# EAGLE design quasi_bb_shield_midi (EAGLE 9.4.2)
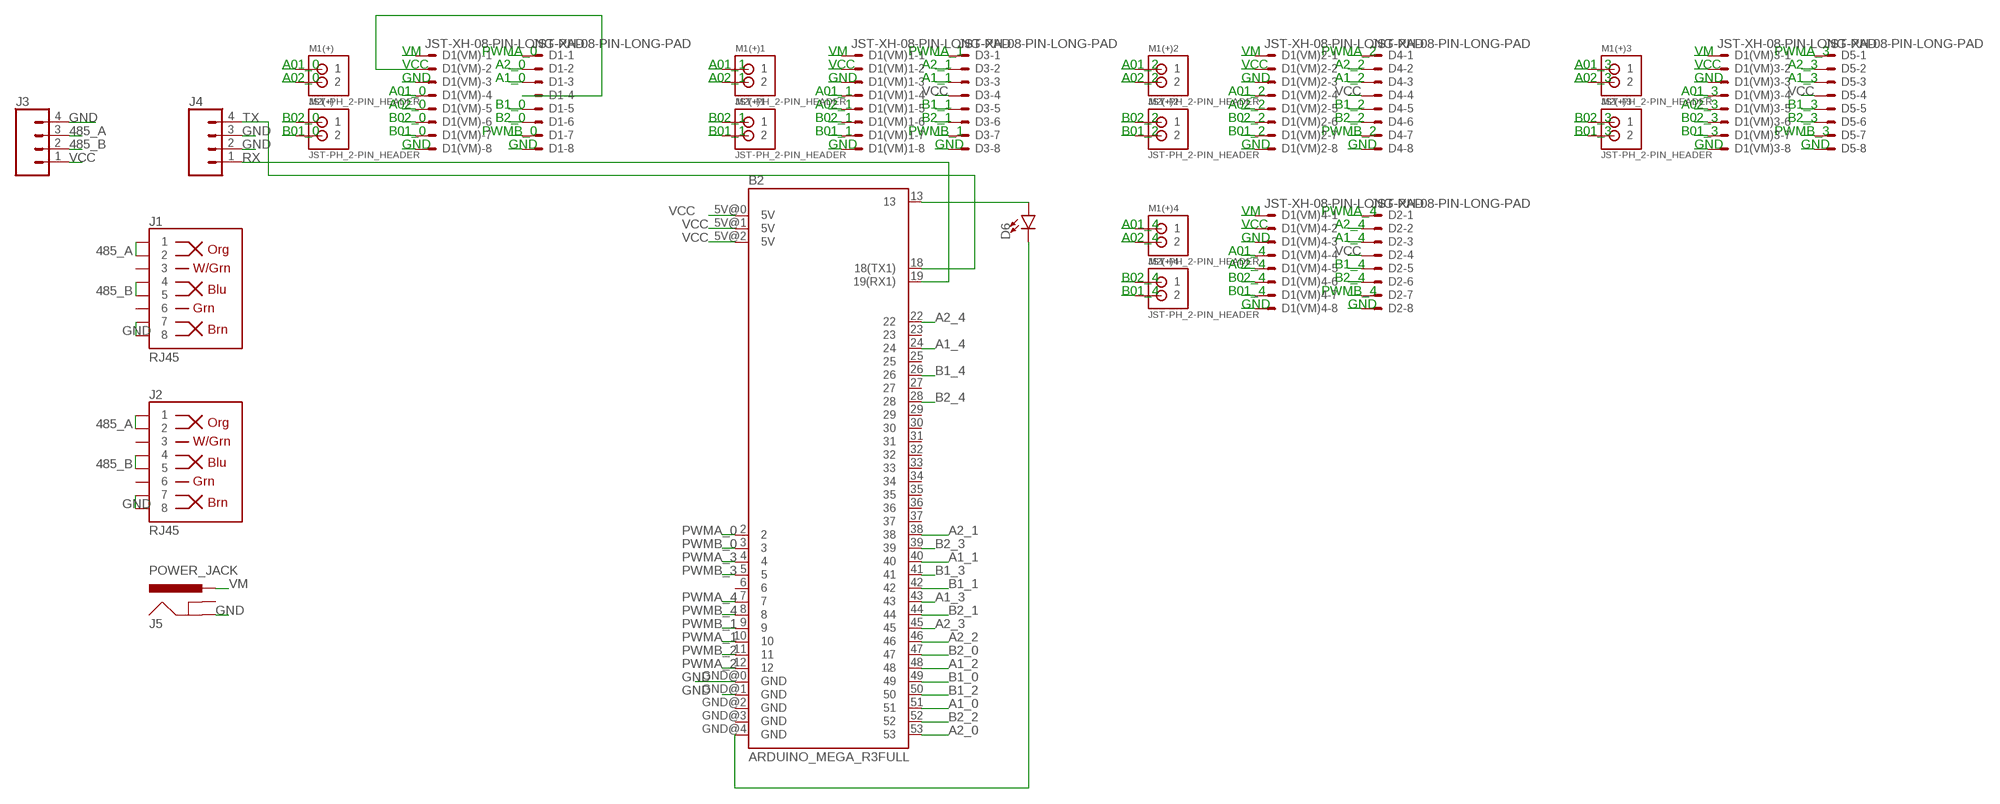
[diagram p0: schematic, sheet 1]

## Parts
B2  ARDUINO_MEGA_R3FULL  [ARDUINO_MEGA]
D1  JST-XH-08-PIN-LONG-PAD  [JST-XH-08-PACKAGE-LONG-PAD]
D1(VM)  JST-XH-08-PIN-LONG-PAD  [JST-XH-08-PACKAGE-LONG-PAD]
D1(VM)1  JST-XH-08-PIN-LONG-PAD  [JST-XH-08-PACKAGE-LONG-PAD]
D1(VM)2  JST-XH-08-PIN-LONG-PAD  [JST-XH-08-PACKAGE-LONG-PAD]
D1(VM)3  JST-XH-08-PIN-LONG-PAD  [JST-XH-08-PACKAGE-LONG-PAD]
D1(VM)4  JST-XH-08-PIN-LONG-PAD  [JST-XH-08-PACKAGE-LONG-PAD]
D2  JST-XH-08-PIN-LONG-PAD  [JST-XH-08-PACKAGE-LONG-PAD]
D3  JST-XH-08-PIN-LONG-PAD  [JST-XH-08-PACKAGE-LONG-PAD]
D4  JST-XH-08-PIN-LONG-PAD  [JST-XH-08-PACKAGE-LONG-PAD]
D5  JST-XH-08-PIN-LONG-PAD  [JST-XH-08-PACKAGE-LONG-PAD]
D6  LED-3MM-NO_SILK  [LED_3MM-NS]
J1  RJ45  RJ45-8  [RJ45-8]
J2  RJ45  RJ45-8  [RJ45-8]
J3  CONN_04  [1X04]
J4  CONN_04  [1X04]
J5  POWER_JACK  [POWER_JACK_PTH]
M1(+)  JST-PH_2-PIN_HEADER  [JST_B2B-PH_HEADER]
M1(+)1  JST-PH_2-PIN_HEADER  [JST_B2B-PH_HEADER]
M1(+)2  JST-PH_2-PIN_HEADER  [JST_B2B-PH_HEADER]
M1(+)3  JST-PH_2-PIN_HEADER  [JST_B2B-PH_HEADER]
M1(+)4  JST-PH_2-PIN_HEADER  [JST_B2B-PH_HEADER]
M2(+)  JST-PH_2-PIN_HEADER  [JST_B2B-PH_HEADER]
M2(+)1  JST-PH_2-PIN_HEADER  [JST_B2B-PH_HEADER]
M2(+)2  JST-PH_2-PIN_HEADER  [JST_B2B-PH_HEADER]
M2(+)3  JST-PH_2-PIN_HEADER  [JST_B2B-PH_HEADER]
M2(+)4  JST-PH_2-PIN_HEADER  [JST_B2B-PH_HEADER]

## Nets
485_A: J1.1 J1.2 J2.1 J2.2 J3.3
485_B: J1.4 J1.5 J2.4 J2.5 J3.2
A01_0: D1(VM).4 M1(+).P1
A1_0: B2.51 D1.3
A01_1: D1(VM)1.4 M1(+)1.P1
A1_1: B2.40 D3.3
A01_2: D1(VM)2.4 M1(+)2.P1
A1_2: B2.48 D4.3
A01_3: D1(VM)3.4 M1(+)3.P1
A1_3: B2.43 D5.3
A01_4: D1(VM)4.4 M1(+)4.P1
A1_4: B2.24 D2.3
A02_0: D1(VM).5 M1(+).P2
A2_0: B2.53 D1.2
A02_1: D1(VM)1.5 M1(+)1.P2
A2_1: B2.38 D3.2
A02_2: D1(VM)2.5 M1(+)2.P2
A2_2: B2.46 D4.2
A02_3: D1(VM)3.5 M1(+)3.P2
A2_3: B2.45 D5.2
A02_4: D1(VM)4.5 M1(+)4.P2
A2_4: B2.22 D2.2
B01_0: D1(VM).7 M2(+).P2
B1_0: B2.49 D1.5
B01_1: D1(VM)1.7 M2(+)1.P2
B1_1: B2.42 D3.5
B01_2: D1(VM)2.7 M2(+)2.P2
B1_2: B2.50 D4.5
B01_3: D1(VM)3.7 M2(+)3.P2
B1_3: B2.41 D5.5
B01_4: D1(VM)4.7 M2(+)4.P2
B1_4: B2.26 D2.5
B02_0: D1(VM).6 M2(+).P1
B2_0: B2.47 D1.6
B02_1: D1(VM)1.6 M2(+)1.P1
B2_1: B2.44 D3.6
B02_2: D1(VM)2.6 M2(+)2.P1
B2_2: B2.52 D4.6
B02_3: D1(VM)3.6 M2(+)3.P1
B2_3: B2.39 D5.6
B02_4: D1(VM)4.6 M2(+)4.P1
B2_4: B2.28 D2.6
GND: B2.GND@0(GND) B2.GND@1(GND) D1(VM)1.3 D1(VM)1.8 D1(VM)2.3 D1(VM)2.8 D1(VM)3.3 D1(VM)3.8 D1(VM)4.3 D1(VM)4.8 D1(VM).3 D1(VM).8 D1.8 D2.8 D3.8 D4.8 D5.8 J1.7 J1.8 J2.7 J2.8 J3.4 J4.2 J4.3 J5.GND
N$1: B2.13 D6.A
N$2: B2.GND@4(GND) D6.K(C)
PWMA_0: B2.2 D1.1
PWMA_1: B2.10 D3.1
PWMA_2: B2.12 D4.1
PWMA_3: B2.4 D5.1
PWMA_4: B2.7 D2.1
PWMB_0: B2.3 D1.7
PWMB_1: B2.9 D3.7
PWMB_2: B2.11 D4.7
PWMB_3: B2.5 D5.7
PWMB_4: B2.8 D2.7
RX: B2.19(19(RX1)) J4.1
TX: B2.18(18(TX1)) J4.4
VCC: B2.5V@0(5V) B2.5V@1(5V) B2.5V@2(5V) D1(VM)1.2 D1(VM)2.2 D1(VM)3.2 D1(VM)4.2 D1(VM).2 D1.4 D2.4 D3.4 D4.4 D5.4 J3.1
VM: D1(VM)1.1 D1(VM)2.1 D1(VM)3.1 D1(VM)4.1 D1(VM).1 J5.PWR
Unconnected: B2.6 B2.23 B2.25 B2.27 B2.29 B2.30 B2.31 B2.32 B2.33 B2.34 B2.35 B2.36 B2.37 B2.GND@2(GND) B2.GND@3(GND) J1.3 J1.6 J2.3 J2.6 J5.GNDBREAK

## Library data of the parts
B2 = mega-simple:ARDUINO_MEGA_R3: Arduino Mega R3 ATmega2560 R3 compatible footprint. SparkFun Products: Arduino Mega 2560 R3 <https://www.sparkfun.com/products/11061>
D1 D1(VM) D1(VM)1-D1(VM)4 D2-D5 = Rembrandt Electronics - JST XH Connectors v1-0:JST-XH-08-PIN: JST XH Connector 2 Pin Wire to board connector. Pitch: 2,54 mm, (0.100") Number of pins: 8 Created by Rembrandt Electronics www.rembrandtelectronics.com
D6 = SparkFun-LED:LED: LED (Generic) Standard schematic elements and footprints for 5mm, 3mm, 1206, and 0603 sized LEDs. Generic LEDs with no color specified.
J1 J2 = SparkFun-Connectors:RJ45-8: RJ45 Jack - 8 pin Simple RJ45, 8-pin connection. Commonly used for Cat5, Cat5e, and Cat6 Ethernet cables. Here is the connector we sell at SparkFun: RJ45 8-Pin Connector <https://www.sparkfun.com/products/643> (PRT-00643) Datasheet <https://cdn.sparkfun.com/datasheets/Prototyping/04908.pdf> It is used on this SparkFun product: SparkFun RJ45 Breakout <https://www.sparkfun.com/products/716> (BOB-00716) Note, you may also be interested in the "MAGJACK" version of this. It is basically a RJ45 connector, but also has some status LEDs built into the connector housing. You can check that out in this library at the device named "MAGJACK.dev" and see these products online: RJ45 Ethernet MagJack-Compatible <https://www.sparkfun.com/products/8534> (PRT-08534) SparkFun RJ45 MagJack Breakout <https://www.sparkfun.com/products/13021> (BOB-13021); PROD_ID: CONN-08506; SF_ID: PRT-00643
J3 J4 = SparkFun-Connectors:CONN_04: Multi connection point. Often used as Generic Header-pin footprint for 0.1 inch spaced/style header connections On any of the 0.1 inch spaced packages, you can populate with these: Break Away Headers - Straight <https://www.sparkfun.com/products/116> (PRT-00116) Break Away Male Headers - Right Angle <https://www.sparkfun.com/products/553> (PRT-00553) Female Headers <https://www.sparkfun.com/products/115> (PRT-00115) Break Away Headers - Machine Pin <https://www.sparkfun.com/products/117> (PRT-00117) Break Away Female Headers - Swiss Machine Pin <https://www.sparkfun.com/products/743> (PRT-00743) For SCREWTERMINALS and SPRING TERMINALS visit here: Screw Terimnals on SparkFun.com <https://www.sparkfun.com/search/results?term=Screw+Terminals> (5mm/3.5mm/2.54mm spacing) This device is also useful as a general connection point to wire up your design to another part of your project. Our various solder wires solder well into these plated through hole pads. Hook-Up Wire - Assortment (Stranded, 22 AWG) <https://www.sparkfun.com/products/11375> (PRT-11375) Hook-Up Wire - Assortment (Solid Core, 22 AWG) <https://www.sparkfun.com/products/11367> (PRT-11367) View the entire wire category on our website here <https://www.sparkfun.com/categories/141> Special notes: Molex polarized connector foot print use with SKU : PRT-08231 with associated crimp pins and housings. 1MM SMD Version SKU: PRT-10208; PROD_ID: CONN-09696
J5 = SparkFun-Connectors:POWER_JACK: Power Jack Connector This is the standard 5.5mm barrel jack for power. The PTH is the most common, proven, reliable, footprint. The Slot footprint only works if the mill layer is transmitted to the PCB fab house so be warned. Here are the connectors we sell at SparkFun: DC Barrel Power Jack/Connector <https://www.sparkfun.com/products/119> (PRT-00119) DC Barrel Power Jack/Connector (SMD) <https://www.sparkfun.com/products/12748> (PRT-12748) DC Barrel Jack Adapter - Breadboard Compatible <https://www.sparkfun.com/products/10811> (PRT-10811) It is used on this SparkFun product (and many, many others): SparkFun RedBoard - Programmed with Arduino <https://www.sparkfun.com/products/12757> (DEV-12757) Also, if you need a mating power supply or connector, please check these out: Wall Adapter Power Supply - 9VDC 650mA <https://www.sparkfun.com/products/298> (TOL-00298) DC Barrel Jack Adapter - Male <https://www.sparkfun.com/products/10287> (PRT-10287); PROD_ID: CONN-08197
M1(+) M1(+)1-M1(+)4 M2(+) M2(+)1-M2(+)4 = con-jst-ph:JST-PH_2-PIN_HEADER: 2-pin JST PH Shrouded Header, top entry P/N B2B-PH-K-S Mating connector PHR-2 Mating cable assembly: Sparkfun PRT-09914 <http://www.sparkfun.com/products/9914>

## Board
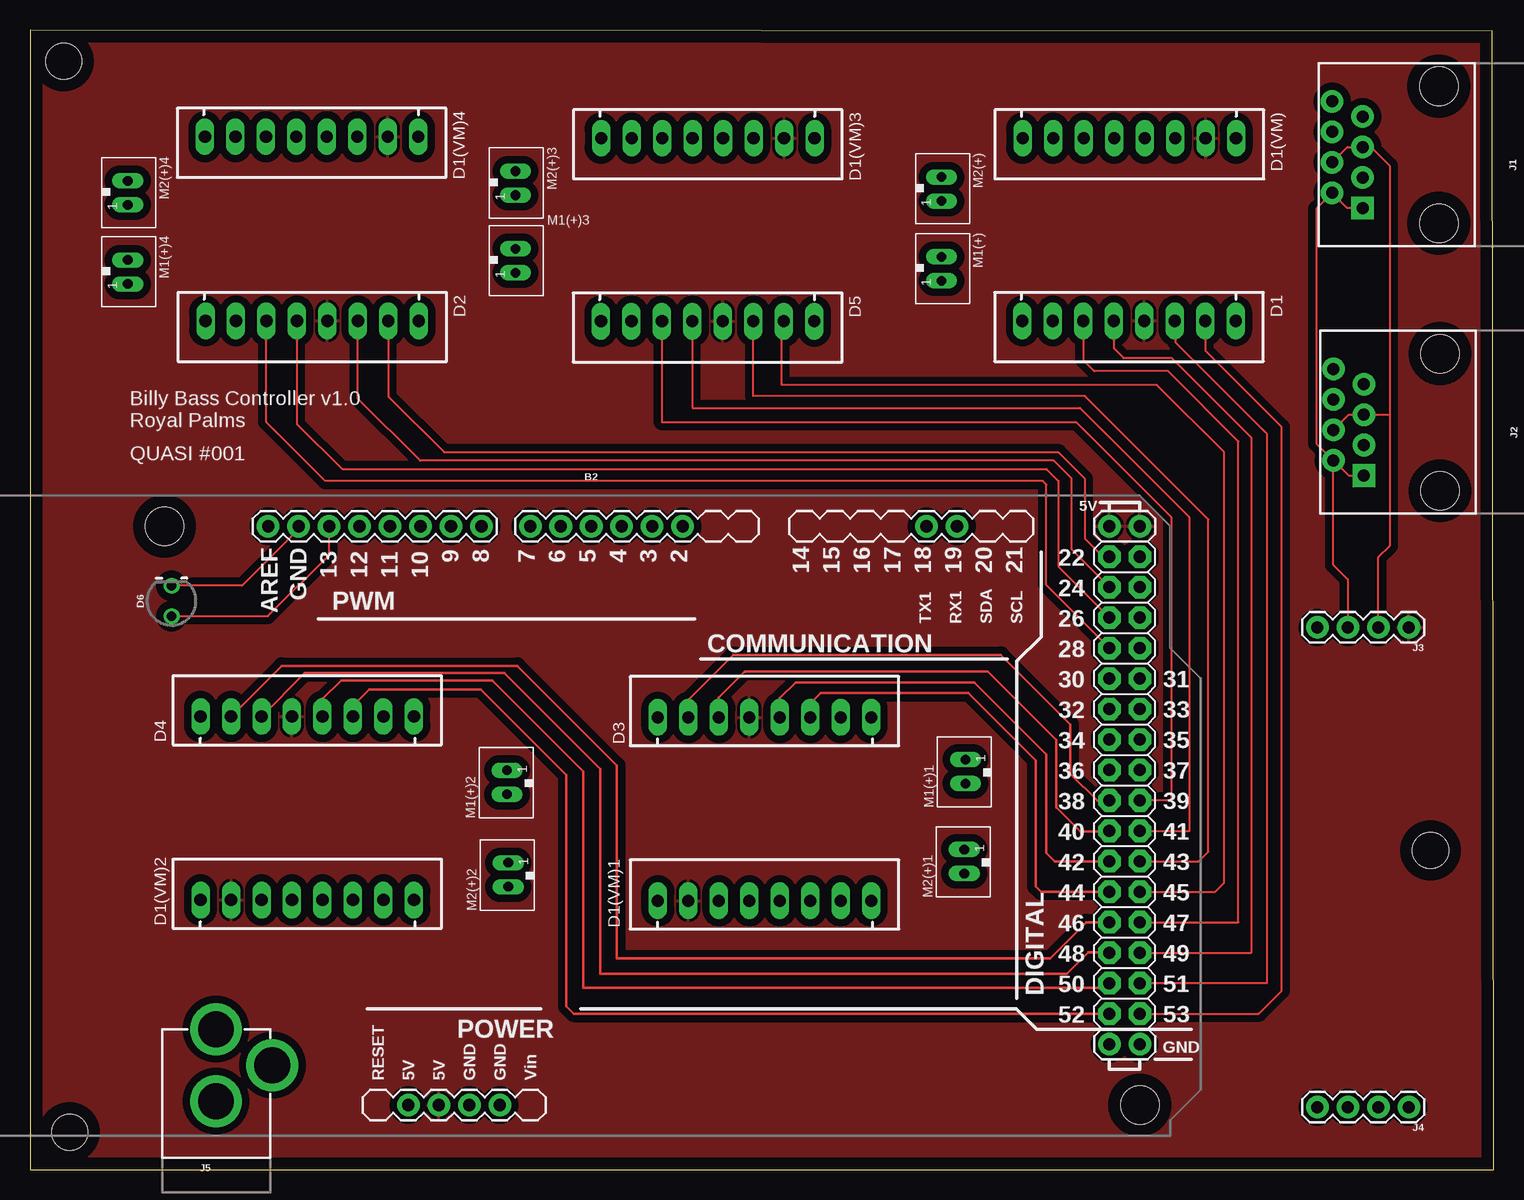
[diagram p1: board, top side]
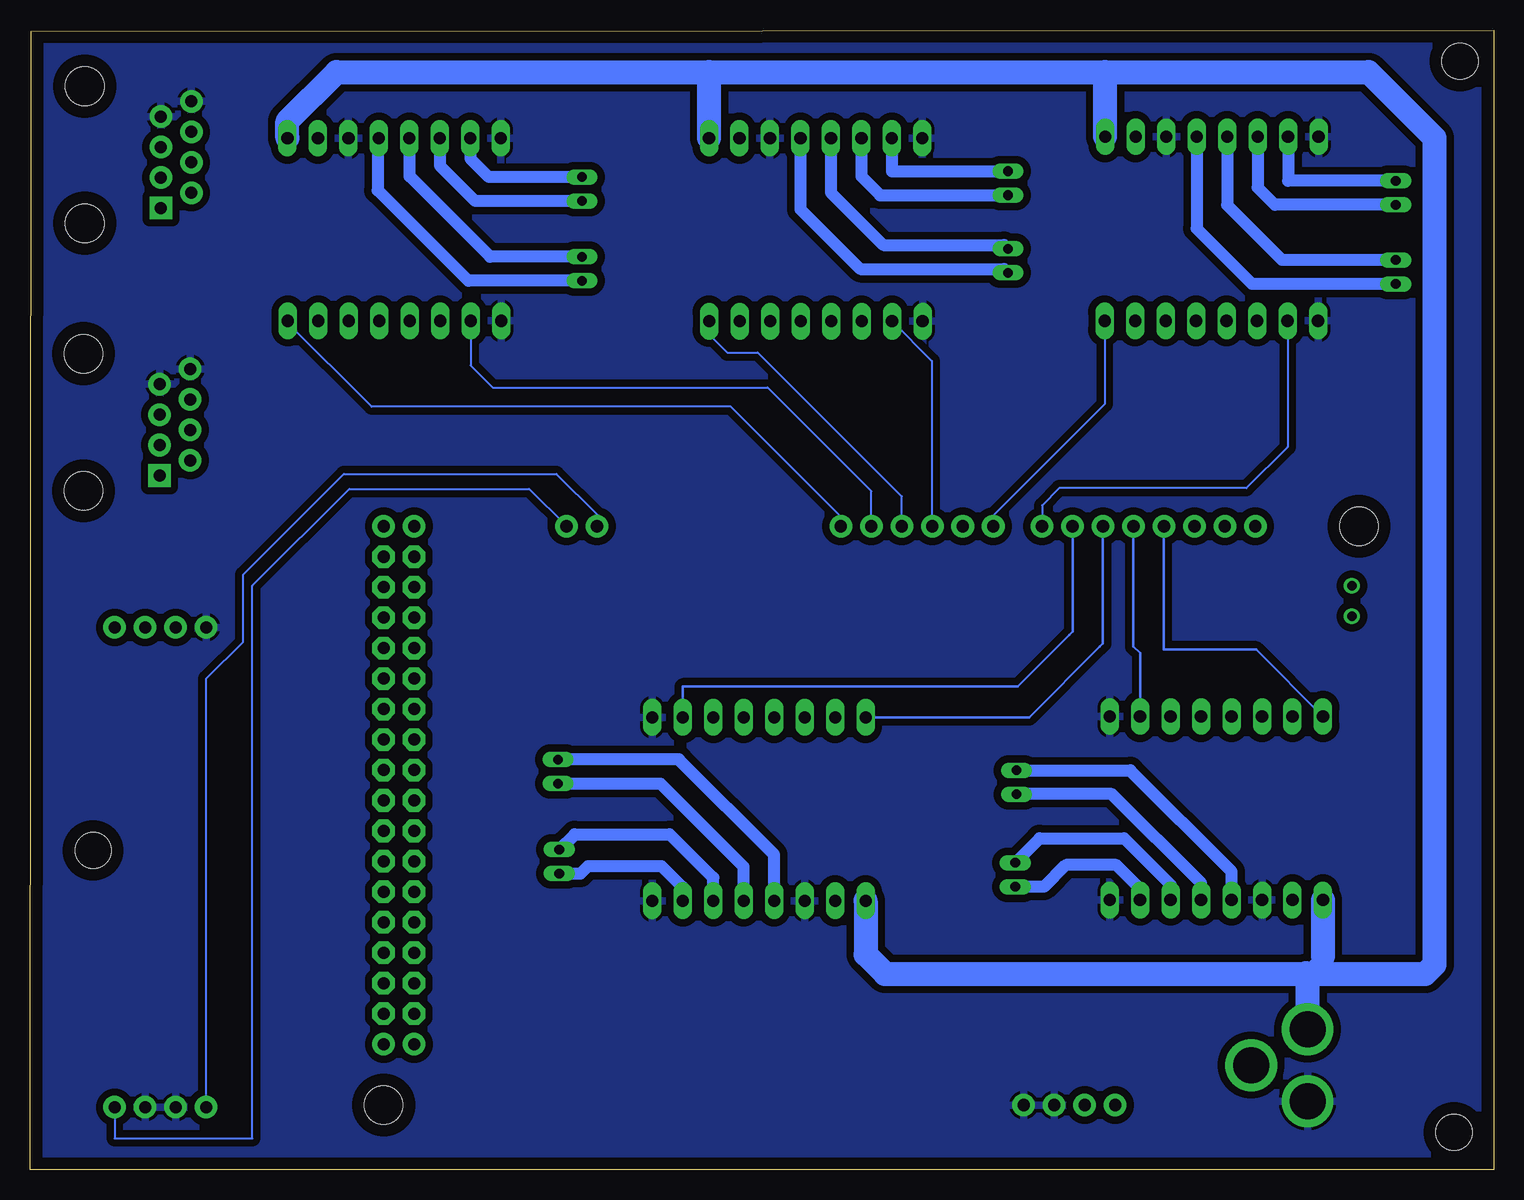
[diagram p2: board, bottom side, seen from below]

Size 121.96 x 95 mm. Coordinates in mm from the lower left corner, seen from the top.
Outline: 0,0 121.96,0 121.86,94.9 0,95 0,0
Copper layers (1*16): Top 0.072mm / dielectric 1.5mm / Bottom 0.072mm
Design rules "default *": minimum track width 6mil, minimum drill 0.35mm, track to track 12mil, track to pad 12mil, pad to pad 12mil, via to via 12mil, smd to smd 6mil, copper to edge 40mil, drill to drill 12mil, minimum pad ring 10mil, minimum via ring 8mil, stop-mask expansion 4mil, vias tented up to drill 0mil, thermal gap 10mil
Holes 3 mm at 2.8,92.4 3.3,3.1 116.7,26.6

### Footprints (pad centres in the part's own frame; a part is rotated, then mirrored left to right if it is on the bottom)
ARDUINO_MEGA = drill 1.016 pad 1.88: 2 8.89,24.13; 3 6.35,24.13; 3.3V -13.97,-24.13; 4 3.81,24.13; 5 1.27,24.13; 5V@0 -11.43,-24.13; 5V@1 44.45,24.13; 5V@2 46.99,24.13; 6 -1.27,24.13; 7 -3.81,24.13; 8 -7.874,24.13; 9 -10.414,24.13; 10 -12.954,24.13; 11 -15.494,24.13; 12 -18.034,24.13; 13 -20.574,24.13; 18 29.21,24.13; 19 31.75,24.13; AREF -25.654,24.13; GND@0 -8.89,-24.13; GND@1 -6.35,-24.13; GND@2 44.45,-19.05; GND@3 46.99,-19.05; GND@4 -23.114,24.13 | drill 1.016 pad 1.88 octagon: 22 44.45,21.59; 23 46.99,21.59; 24 44.45,19.05; 25 46.99,19.05; 26 44.45,16.51; 27 46.99,16.51; 28 44.45,13.97; 29 46.99,13.97; 30 44.45,11.43; 31 46.99,11.43; 32 44.45,8.89; 33 46.99,8.89; 34 44.45,6.35; 35 46.99,6.35; 36 44.45,3.81; 37 46.99,3.81; 38 44.45,1.27; 39 46.99,1.27; 40 44.45,-1.27; 41 46.99,-1.27; 42 44.45,-3.81; 43 46.99,-3.81; 44 44.45,-6.35; 45 46.99,-6.35; 46 44.45,-8.89; 47 46.99,-8.89; 48 44.45,-11.43; 49 46.99,-11.43; 50 44.45,-13.97; 51 46.99,-13.97; 52 44.45,-16.51; 53 46.99,-16.51 | hole 3.2: -34.29,24.13; 46.99,-24.13
JST-XH-08-PACKAGE-LONG-PAD = drill 1.016 long: 1 -8.89,0; 2 -6.35,0; 3 -3.81,0; 4 -1.27,0; 5 1.27,0; 6 3.81,0; 7 6.35,0; 8 8.89,0
LED_3MM-NS = drill 0.813: A -1.27,0; K 1.27,0
RJ45-8 = drill 1 pad 1.88 square: 1 -4.445,6.35 | drill 1 pad 1.88: 2 -3.175,8.89; 3 -1.905,6.35; 4 -0.635,8.89; 5 0.635,6.35; 6 1.905,8.89; 7 3.175,6.35; 8 4.445,8.89 | hole 3.2: -5.715,0; 5.715,0
1X04 = drill 1.016 pad 1.88: 1 0,0; 2 2.54,0; 3 5.08,0; 4 7.62,0
POWER_JACK_PTH = drill 2.997 pad 4.318: GND 0,7.7; GNDBREAK 4.7,10.7; PWR 0,13.7
JST_B2B-PH_HEADER = drill 0.8 long: P1 1.075,0.048; P2 -0.925,0.048

### Placement (x,y rotation side)
B2  45.5,29.5 0 top
D1  91.59,70.75 180 top
D1(VM)  91.62,85.99 180 top
D1(VM)1  61.21,22.41 0 top
D1(VM)2  23.1,22.47 0 top
D1(VM)3  56.49,85.98 180 top
D1(VM)4  23.47,86.11 180 top
D2  23.52,70.75 180 top
D3  61.21,37.7 0 top
D4  23.1,37.77 0 top
D5  56.47,70.72 180 top
D6  11.8,47.4 90 top
J1  117.4,84.6 90 top
J2  117.5,62.3 90 top
J3  114.9,45.2 180 top
J4  114.9,5.2 180 top
J5  15.5,-2 0 top
M1(+)  75.91,75.17 270 top
M1(+)1  78,33.1 90 top
M1(+)2  39.8,32.2 90 top
M1(+)3  40.41,75.83 270 top
M1(+)4  8.1,74.9 270 top
M2(+)  75.91,81.81 270 top
M2(+)1  77.9,25.6 90 top
M2(+)2  39.9,24.5 90 top
M2(+)3  40.41,82.3 270 top
M2(+)4  8.1,81.5 270 top

### Tracks (layer width: path | path; a pad name or v marks a point on that pad's centre or on a via)
485_A
  Top 0.152: J3.3 109.82,49.2 108.61,50.41 J2.2 | J1.1 109.78,80.16 J1.2 107.2,80.11 107.2,60.53 J2.2 | J2.1 109.88,57.86 J2.2
485_B
  Top 0.152: J3.2 112.36,51.06 113.3,52 113.3,62.94 | J2.4 109.88,62.94 J2.5 113.3,62.94 | J1.4 109.78,85.23 J1.5 111.77,85.23 113.3,83.7 113.3,62.94
A01_0
  Bottom 1.016: M1(+).P1 85.44,74.09 92.99,81.64 92.99,85.88 D1(VM).4
A1_0
  Top 0.152: D1.3 95.48,70.67 95.48,68.92 103.1,61.3 103.1,15.53 B2.51
A01_1
  Bottom 1.016: D1(VM)1.4 59.94,26.26 67.88,34.2 77.93,34.2 M1(+)1.P1
A1_1
  Top 0.2: D3.3 57.4,39.35 59.56,41.51 59.56,41.47 59.6,41.51 79.81,41.51 85.5,35.81 85.5,30.2 87.5,28.2 89.92,28.2 B2.40
A01_2
  Bottom 1.016: M1(+)2.P1 30.26,33.27 21.83,24.85 D1(VM)2.4
A1_2
  Top 0.2: D4.3 22.91,41.39 39.51,41.39 47.5,33.4 47.5,16.3 86.4,16.3 88.2,18.1 89.92,18.1 B2.48
A01_3
  Bottom 1.016: M1(+)3.P1 40.77,75.07 52.77,75.07 57.76,80.06 D1(VM)3.4
A1_3
  Top 0.152: B2.43 97.39,25.69 98.2,26.5 98.2,54.2 87.9,64.5 60.27,64.5 60.27,70.71 D5.3
A01_4
  Bottom 1.016: M1(+)4.P1 20.12,73.83 24.74,78.44 D1(VM)4.4
A1_4
  Top 0.152: B2.24 86.8,51.7 86.8,57.6 85.3,59.1 32.5,59.1 27.33,64.27 D2.3
A02_0
  Bottom 1.016: M1(+).P2 83.62,76.09 90.33,82.8 90.33,85.98 D1(VM).5
A2_0
  Top 0.152: D1.2 97.94,68.26 104.3,61.9 104.3,14.9 102.39,12.99 B2.53
A02_1
  Bottom 1.016: M1(+)1.P2 69.42,32.17 62.48,25.24 D1(VM)1.5
A2_1
  Top 0.2: D3.2 54.86,39.16 58.6,42.9 80.9,42.9 86.7,37.1 86.7,33 88.93,30.77 B2.38
A02_2
  Bottom 1.016: D1(VM)2.5 24.37,23.88 31.79,31.3 39.73,31.3 M1(+)2.P2
A2_2
  Top 0.2: D4.2 20.96,41.98 40.62,41.98 48.9,33.7 48.9,17.6 85,17.6 88.01,20.61 B2.46
A02_3
  Bottom 1.016: D1(VM)3.5 55.22,81.44 50.85,77.07 40.77,77.07 M1(+)3.P2
A2_3
  Top 0.152: B2.45 98.75,23.15 99.5,23.9 99.5,59.8 93.9,65.4 62.62,65.4 62.62,70.52 D5.2
A02_4
  Bottom 1.016: M1(+)4.P2 17.62,75.83 22.2,80.4 D1(VM)4.5
A2_4
  Top 0.152: D2.2 29.87,64.43 34.5,59.8 85.7,59.8 87.9,57.6 87.9,52.6 89.41,51.09 B2.22
B01_0
  Bottom 1.016: M2(+).P2 83.72,82.74 85.27,84.29 D1(VM).7
B1_0
  Top 0.152: D1.5 90.32,68.46 91.14,67.64 95.16,67.64 101.8,61 101.8,18.1 101.77,18.07 B2.49
B01_1
  Bottom 1.016: M2(+)1.P2 76.08,24.68 75.44,25.31 69.34,25.31 67.56,23.53 D1(VM)1.7
B1_1
  Top 0.2: D3.5 62.48,39.3 63.79,40.61 78.69,40.61 84.7,34.6 84.7,26.4 85.41,25.69 B2.42
B01_2
  Bottom 1.016: D1(VM)2.7 29.45,23.41 31.42,25.38 35.64,25.38 37.44,23.57 M2(+)2.P2
B1_2
  Top 0.2: D4.5 24.37,39.21 25.93,40.77 38.53,40.77 46.1,33.2 46.1,15.13 89.55,15.13 B2.50
B01_3
  Bottom 1.016: D1(VM)3.7 50.14,83.22 M2(+)3.P2
B1_3
  Top 0.152: D5.5 55.2,63.5 87.5,63.5 96.6,54.4 96.6,28.2 92.52,28.2 B2.41
B01_4
  Bottom 1.016: M2(+)4.P2 17.12,82.42 D1(VM)4.7
B1_4
  Top 0.152: D2.5 22.25,62.15 26,58.4 84.7,58.4 85.7,57.4 85.7,50.26 B2.26
B02_0
  Bottom 1.016: D1(VM).6 87.81,83.71 84.84,80.74 M2(+).P1
B2_0
  Top 0.152: D1.6 87.78,67.46 88.7,66.54 94.86,66.54 100.7,60.7 100.7,20.62 100.69,20.61 B2.47
B02_1
  Bottom 1.016: M2(+)1.P1 76.58,27.95 68.65,27.95 65.02,24.32 D1(VM)1.6
B2_1
  Top 0.2: D3.6 65.02,38.84 65.91,39.73 78.18,39.73 83.8,34.11 83.8,23.6 84.25,23.15 B2.44
B02_2
  Bottom 1.016: M2(+)2.P1 37.82,27.61 30.78,27.61 26.91,23.75 D1(VM)2.6
B2_2
  Top 0.2: D4.6 26.91,38.66 28.28,40.02 37.58,40.02 44.7,32.9 44.7,13.6 45.31,12.99 B2.52
B02_3
  Bottom 1.016: D1(VM)3.6 52.68,82.8 51.11,81.22 M2(+)3.P1
B2_3
  Top 0.152: D5.6 52.66,62.3 87.2,62.3 95.1,54.4 95.1,30.9 94.97,30.77 B2.39
B02_4
  Bottom 1.016: M2(+)4.P1 18.23,80.42 19.66,81.86 D1(VM)4.6
B2_4
  Top 0.152: B2.28 84.7,48.72 84.7,57.1 84.4,57.4 24.6,57.4 19.71,62.29 D2.6
GND
  pour Bottom (isolate 0.61): -18.61,139.7 -17.8,-6.16 175.59,-6.16 175.59,139.7
N$1
  Top 0.152: D6.A 19.83,46.13 24.93,51.23 B2.13
N$2
  Top 0.152: B2.GND@4 22.39,53.39 17.67,48.67 D6.K
PWMA_0
  Bottom 0.152: D1.1 100.65,70.75 93.5,63.6 63.56,63.6 54.39,54.43 B2.2
PWMA_1
  Bottom 0.2: 32.8,43.6 38.7,37.7 D3.1
  Bottom 0.203: B2.10 32.55,43.85 32.8,43.6
PWMA_2
  Bottom 0.2: D4.1 19.79,43.34 27.47,43.34
  Bottom 0.203: 27.47,43.34 B2.12
PWMA_3
  Bottom 0.152: B2.4 49.31,56.11 61.32,68.12 63.86,68.12 65.36,69.62 D5.1
PWMA_4
  Bottom 0.152: D2.1 32.41,63.79 41.69,54.51 B2.7
PWMB_0
  Bottom 0.152: D1.7 85.24,67.04 83.4,65.2 60.5,65.2 51.85,56.55 B2.3
PWMB_1
  Bottom 0.152: B2.9 35.09,44.81 35.35,44.55
  Bottom 0.2: D3.7 67.56,40.27 39.63,40.27 35.35,44.55 35.05,44.85
  Bottom 0.203: 35.05,44.85 35.05,53.59 B2.9
PWMB_2
  Bottom 0.2: 29.45,43.05 D4.7
  Bottom 0.203: B2.11 30.01,43.6 29.45,43.05
PWMB_3
  Bottom 0.152: D5.7 46.8,67.4 46.8,53.66 B2.5
PWMB_4
  Bottom 0.152: D2.7 17.17,60.23 20.6,56.8 36.2,56.8 37.63,55.37 B2.8
RX
  Bottom 0.152: B2.19 80.37,56.75 95.35,56.75 103.42,48.68 103.42,2.6 114.9,2.6 J4.1
TX
  Bottom 0.152: B2.18 74.71,54.61 78.1,58 95.8,58 104.2,49.6 104.2,44 107.28,40.92 J4.4
VCC
  pour Top (isolate 0.61): 167.55,225.37 167.55,-4.15 -129.04,-4.15
VM
  Bottom 1.016: 50.7,16.3 15.7,16.3 | 15.7,16.3 5.7,16.3 | 14.21,17.79 15.61,16.39 15.7,16.3
  Bottom 2: D1(VM)1.1 52.32,17.92 50.7,16.3 5.7,16.3 4.9,17.1 4.9,86 10.4,91.5 32.36,91.5 | D1(VM)4.1 32.36,91.5 | 65.38,91.5 32.36,91.5 | D1(VM)3.1 65.38,91.5 | D1(VM).1 100.51,87.39 96.4,91.5 65.38,91.5 | D1(VM)2.1 14.21,17.79 | J5.PWR 15.5,16.28 15.61,16.39

### Text on the board
tNames: Billy Bass Controller v1.0 / Royal Palms | QUASI #001